# EAGLE design CBMINICONN (EAGLE 9.4.2)
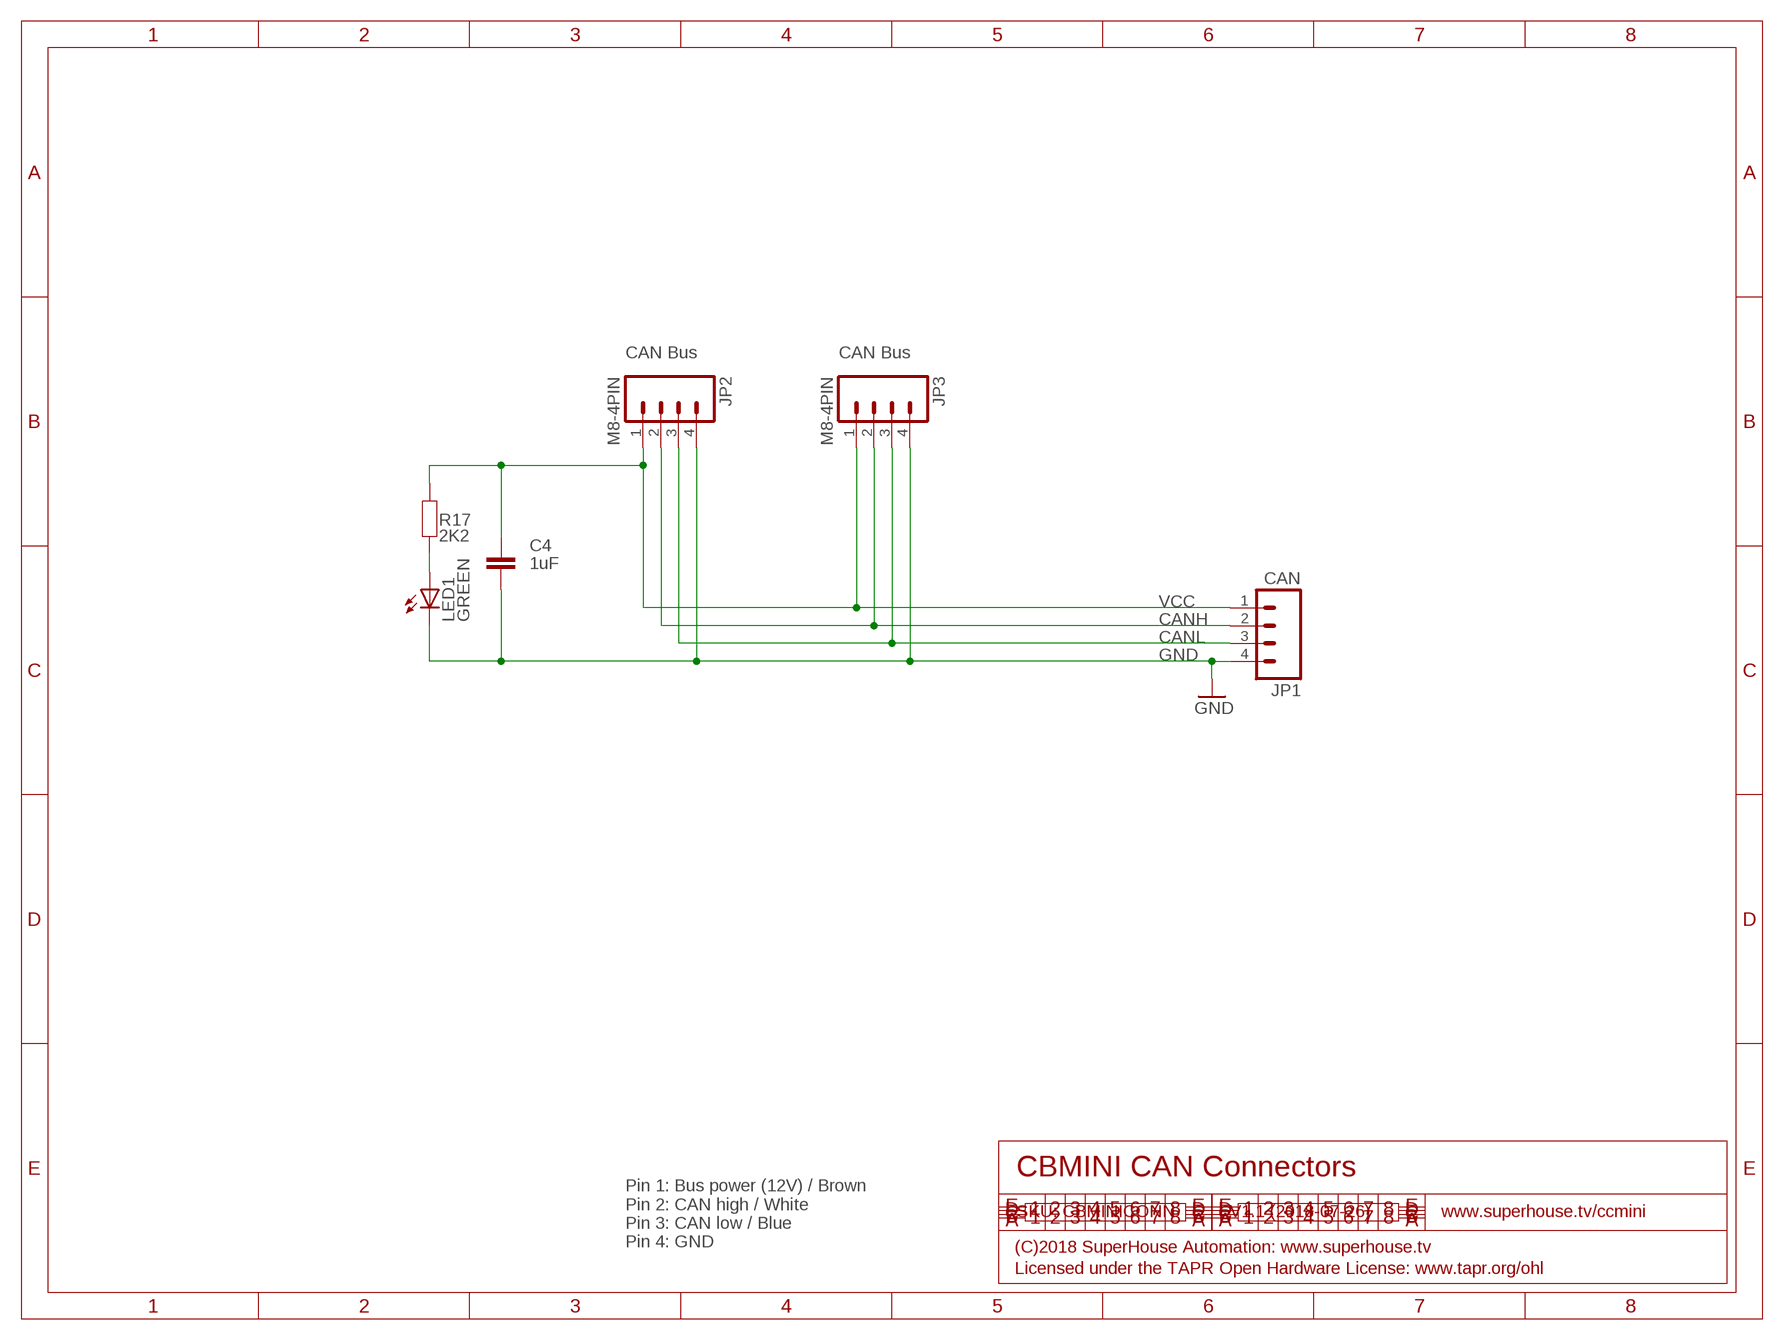
[diagram p0: schematic, sheet 1]

## Parts
C4  1uF  CAP0603  [0603]
JP1  CAN  M04PTH  [1X04]
JP2  M8-4PIN  [M8-4PIN]
JP3  M8-4PIN  [M8-4PIN]
LED1  GREEN  LED3MM  [LED3MM]
R17  2K2  RESISTOR0603  [0603]

## Nets
CANH: JP1.2 JP2.2 JP3.2
CANL: JP1.3 JP2.3 JP3.3
GND: C4.1 JP1.4 JP2.4 JP3.4 LED1.K(C)
N$1: LED1.A R17.1
VCC: C4.2 JP1.1 JP2.1 JP3.1 R17.2

## Notes on the sheet
- CAN Bus | CAN Bus
- CBMINI CAN Connectors
- SKU: CBMINICONN | V1.1 (2018-07-26) | www.superhouse.tv/ccmini
- Pin 1: Bus power (12V) / Brown
  Pin 2: CAN high / White
  Pin 3: CAN low / Blue
  Pin 4: GND
- (C)2018 SuperHouse Automation: www.superhouse.tv
- Licensed under the TAPR Open Hardware License: www.tapr.org/ohl

## Library data of the parts
C4 = freetronics-master-v1.1:CAP: Capacitor Standard 0603 ceramic capacitor, and 0.1" leaded capacitor.
JP1 = freetronics-jon:M04: Header 4 Standard 4-pin 0.1" header. Use with straight break away headers (SKU : PRT-00116), right angle break away headers (PRT-00553), swiss pins (PRT-00743), machine pins (PRT-00117), and female headers (PRT-00115). Molex polarized connector foot print use with SKU : PRT-08231 with associated crimp pins and housings. 1MM SMD Version SKU: PRT-10208
JP2 JP3 = freetronics-jon:M8-4PIN
LED1 = freetronics-jon:LED: LEDs Standard schematic elements and footprints for 5mm, 3mm, 1206, and 0603 sized LEDs. 5mm - Spark Fun Electronics SKU : COM-00529 (and others)
R17 = freetronics-master-v1.1:RESISTOR: Resistor Basic schematic elements and footprints for 0603, 1206, and PTH 1/10th watt (small) resistors.

## Board
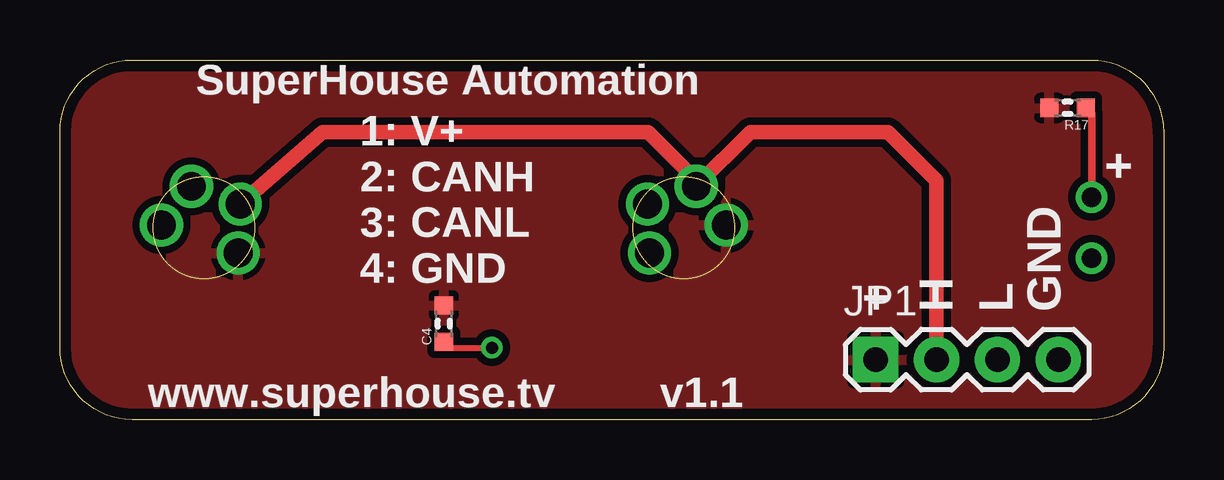
[diagram p1: board, top side]
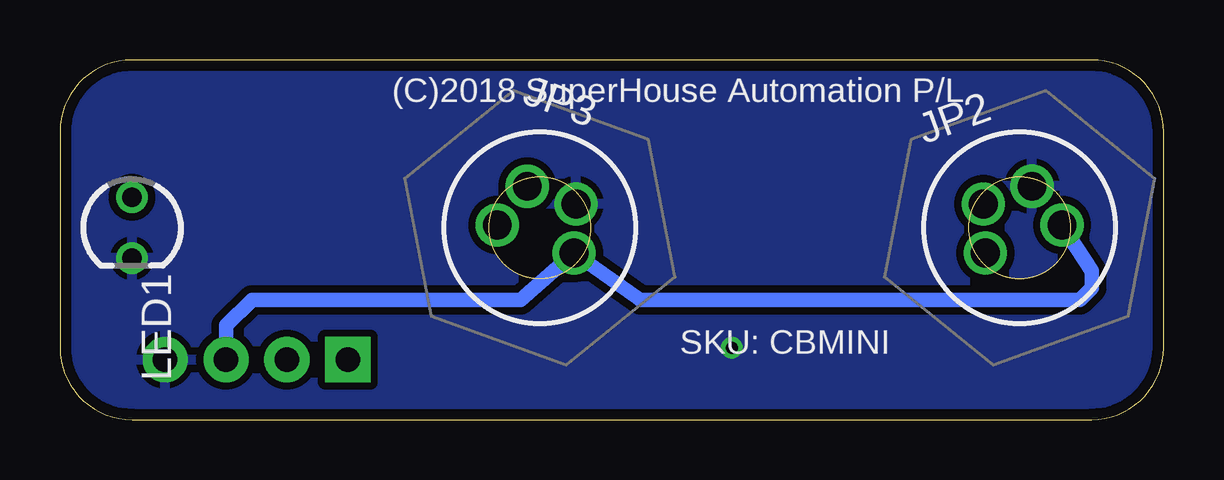
[diagram p2: board, bottom side, seen from below]

Size 46 x 15 mm. Coordinates in mm from the lower left corner, seen from the top.
Outline: 3,15 43,15 arc-90 46,12 46,3 arc-90 43,0 3,0 arc-90 0,3 0,12 arc-90 3,15
Copper layers (1*16): Top 0.035mm / dielectric 1.5mm / Bottom 0.035mm
Design rules "default *": minimum track width 10mil, minimum drill 24mil, track to track 12mil, track to pad 12mil, pad to pad 12mil, via to via 12mil, smd to smd 8mil, copper to edge 18mil, drill to drill 8mil, minimum pad ring 10mil, minimum via ring 8mil, stop-mask expansion 4mil, vias tented up to drill 0mil, thermal gap 10mil
tRestrict: area 3.9,5.9 to 8.1,10.1; area 23.9,5.9 to 28.1,10.1
bRestrict: area 3.9,5.9 to 8.1,10.1; area 23.9,5.9 to 28.1,10.1
Milling: area 3.9,5.9 to 8.1,10.1; area 23.9,5.9 to 28.1,10.1

### Footprints (pad centres in the part's own frame; a part is rotated, then mirrored left to right if it is on the bottom)
0603 = smd 0.762 x 0.762: 1 -0.762,0; 2 0.762,0
1X04 = drill 1.016 pad 1.88 square: 1 0,0 | drill 1.016 pad 1.88: 2 2.54,0; 3 5.08,0; 4 7.62,0
M8-4PIN = drill 1.2 pad 1.676: 1 -1.7,-0.5; 2 -1.08,1.45; 3 1.7,-0.5; 4 1.08,1.45
LED3MM = drill 0.813: A -1.27,0; K 1.27,0

### Placement (x,y rotation side)
C4  16,4 90 top
JP1  34,2.5 0 top
JP2  6,8 20 bottom
JP3  26,8 340 bottom
LED1  43,8 270 bottom
R17  42,13 180 top

### Tracks (layer width: path | path; a pad name or v marks a point on that pad's centre or on a via)
CANH
  Top 0.61: JP2.2 10.95,12 24.5,12 26.52,9.98 JP3.2 28.79,12 34.5,12 36.54,9.96 JP1.2
CANL
  Bottom 0.61: JP1.3 39.08,3.92 38,5 26.8,5 JP3.3 21.8,5 3.5,5 3,5.5 3,6.2 JP2.3
GND  (via drill 0.5)
  Top 0.254: C4.1 16.24,3 v18,3
  pour Bottom: 3,0 43,0 arc90 46,3 46,12 arc90 43,15 3,15 arc90 0,12 0,3 arc90
N$1
  Top 0.305: LED1.A 43,12.76 R17.1
VCC
  pour Top: 3,0 43,0 arc90 46,3 46,12 arc90 43,15 3,15 arc90 0,12 0,3 arc90

### Text on the board
tPlace: SuperHouse Automation | + | 1: V+ / 2: CANH / 3: CANL / 4: GND | + | H | L | GND | www.superhouse.tv | v1.1
bPlace: (C)2018 SuperHouse Automation P/L | SKU: CBMINI